# EAGLE schematic StepperBoard (EAGLE 9.6.2)
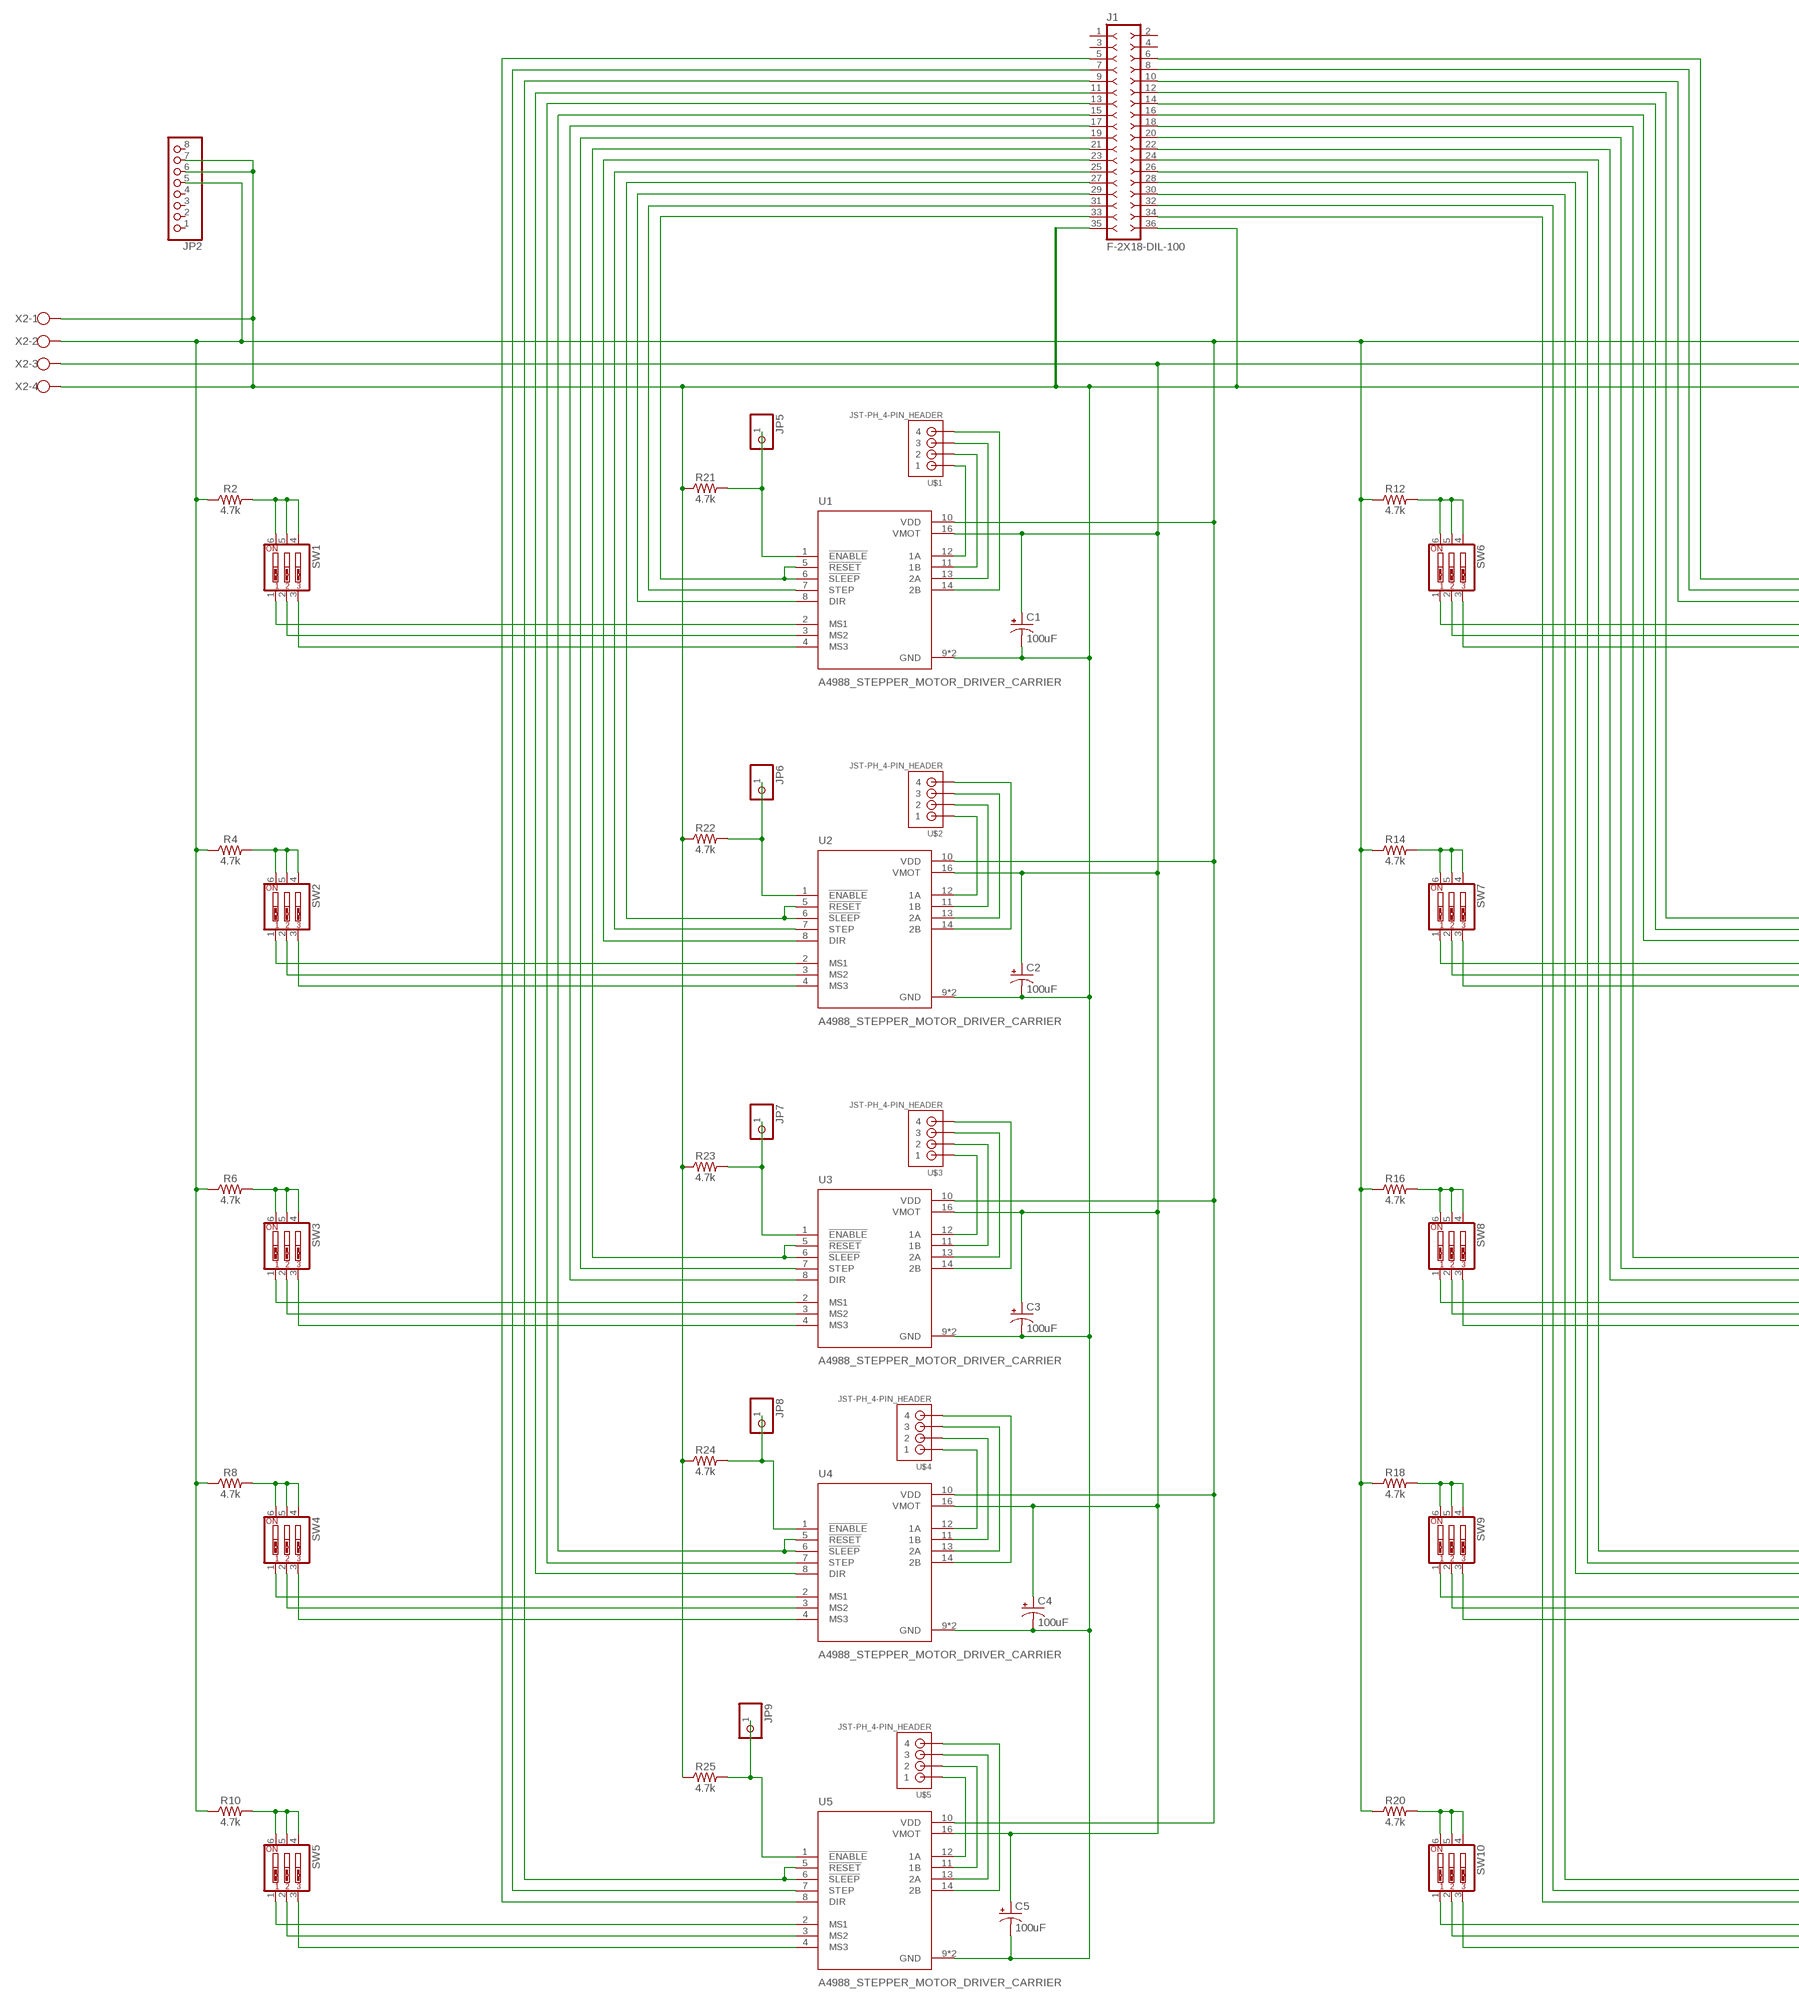
[diagram p0: schematic, sheet 1, part 1 of 2]
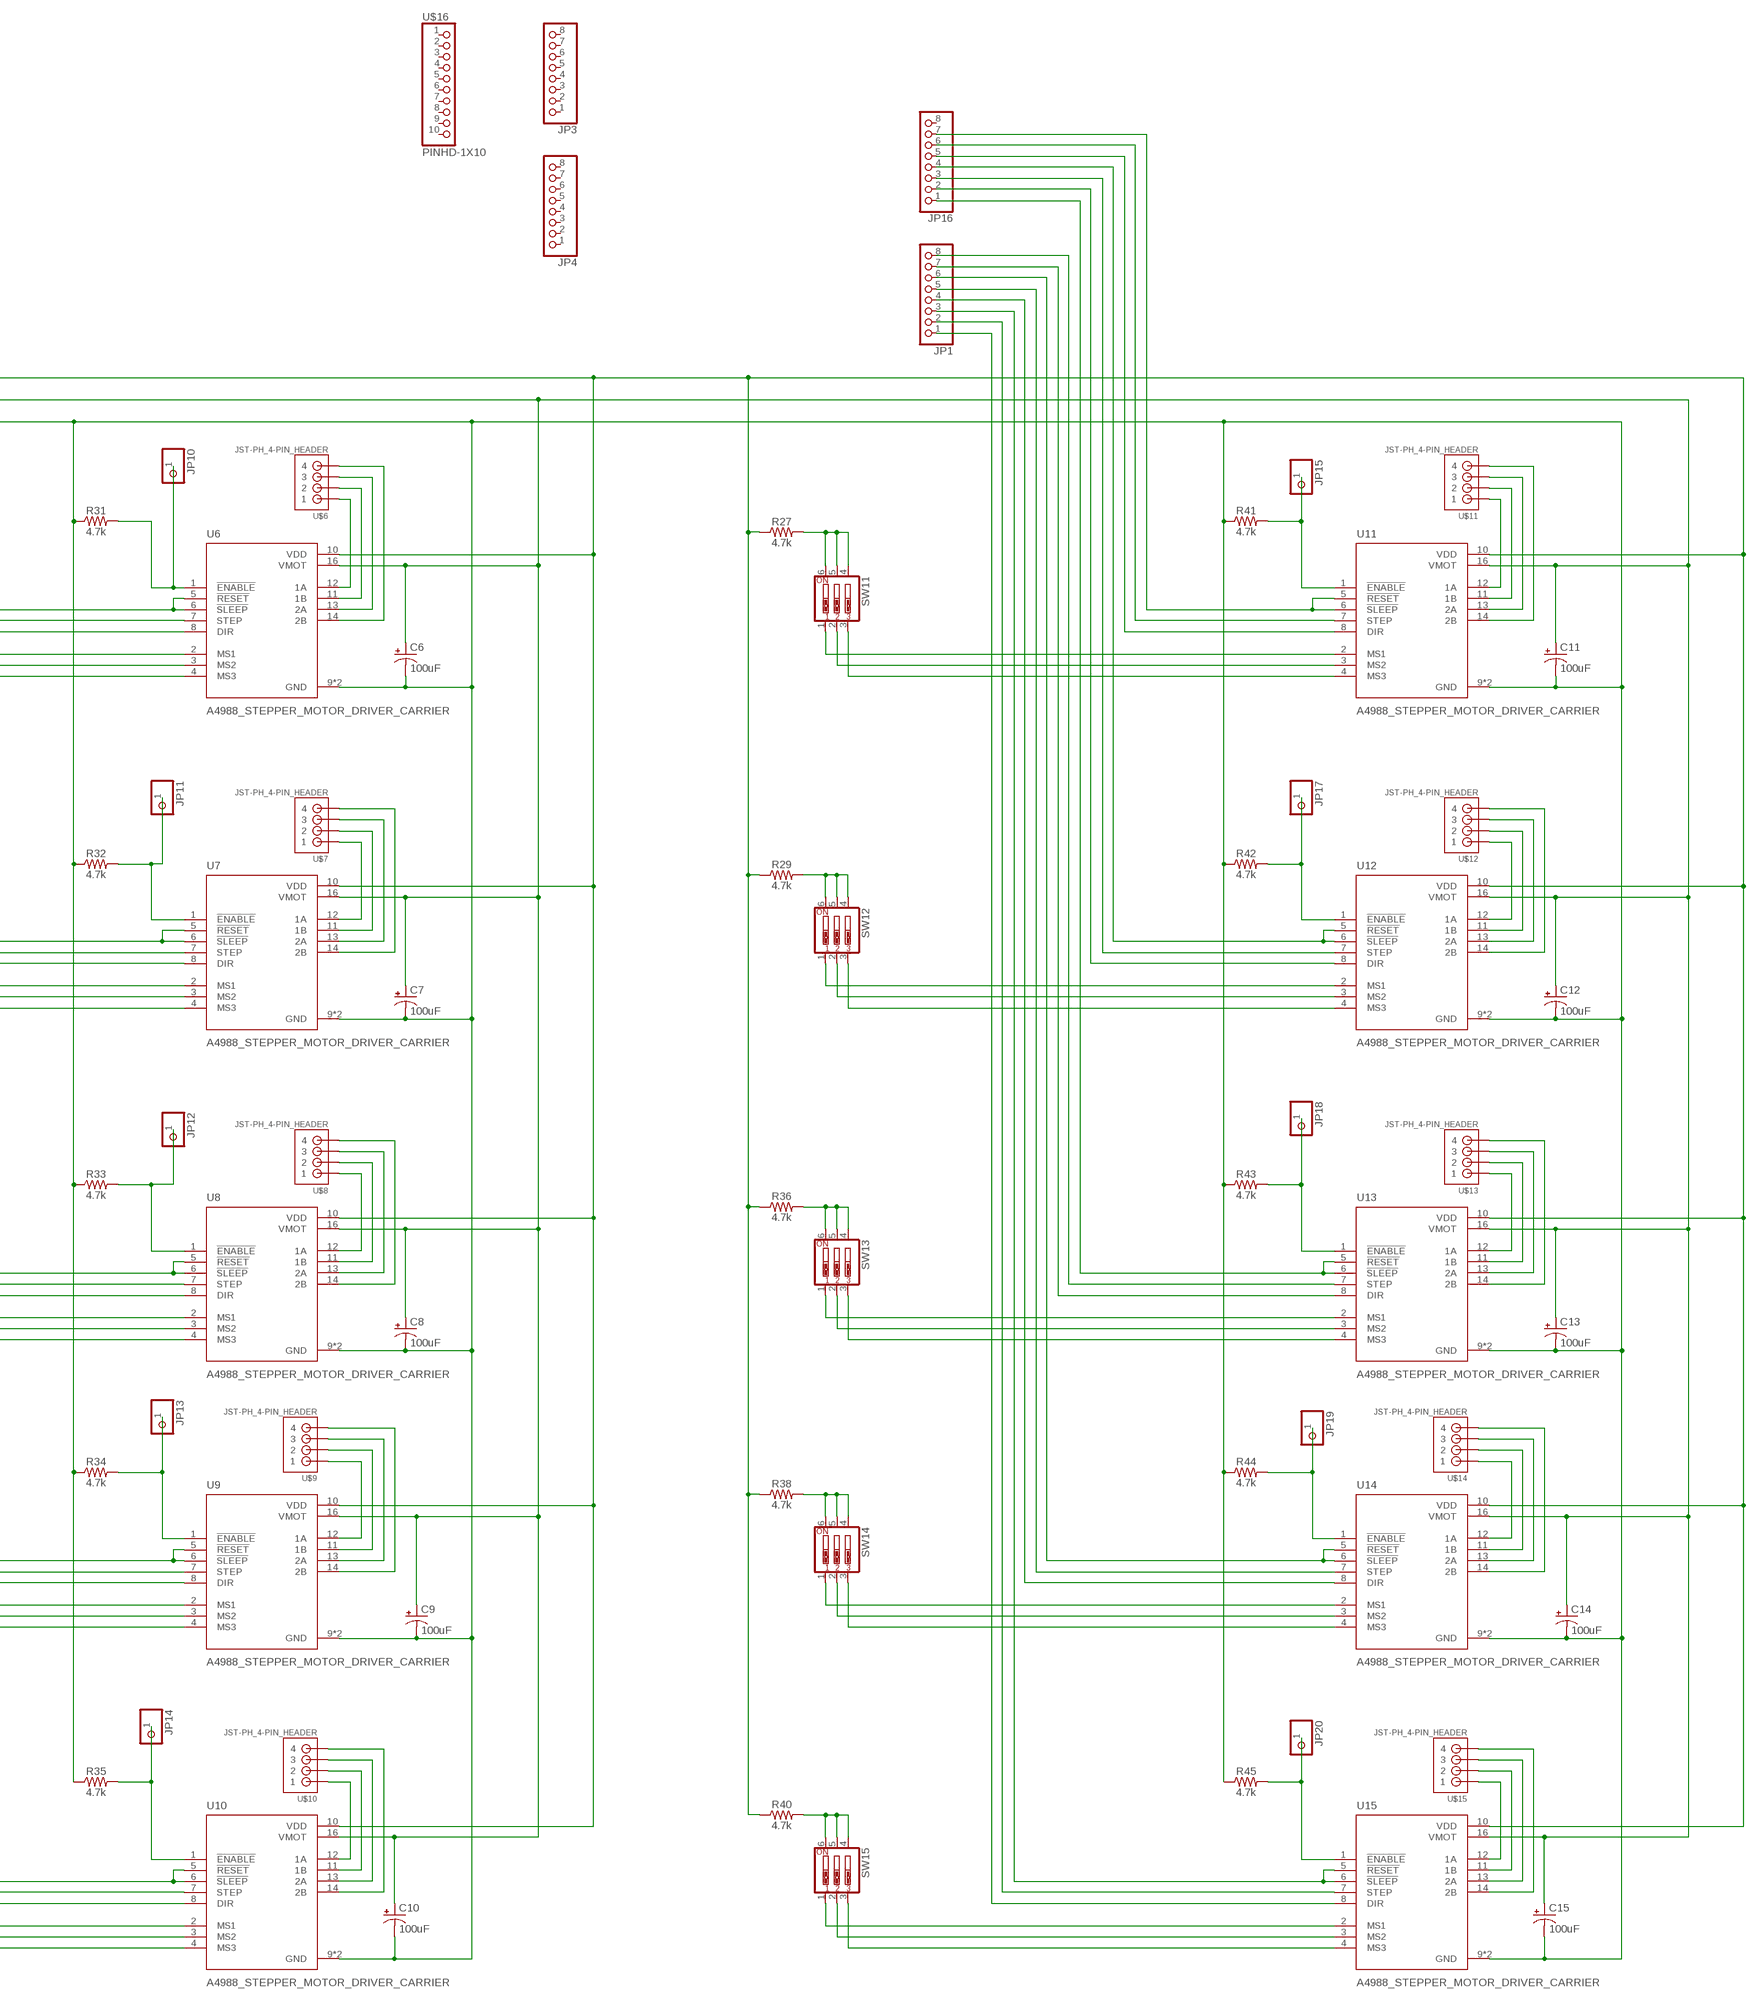
[diagram p1: schematic, sheet 1, part 2 of 2]

## Parts
C1  100uF  100UF-POLAR-RADIAL-2.5MM-25V-20%  [CPOL-RADIAL-2.5MM-6.5MM]
C2  100uF  100UF-POLAR-RADIAL-2.5MM-25V-20%  [CPOL-RADIAL-2.5MM-6.5MM]
C3  100uF  100UF-POLAR-RADIAL-2.5MM-25V-20%  [CPOL-RADIAL-2.5MM-6.5MM]
C4  100uF  100UF-POLAR-RADIAL-2.5MM-25V-20%  [CPOL-RADIAL-2.5MM-6.5MM]
C5  100uF  100UF-POLAR-RADIAL-2.5MM-25V-20%  [CPOL-RADIAL-2.5MM-6.5MM]
C6  100uF  100UF-POLAR-RADIAL-2.5MM-25V-20%  [CPOL-RADIAL-2.5MM-6.5MM]
C7  100uF  100UF-POLAR-RADIAL-2.5MM-25V-20%  [CPOL-RADIAL-2.5MM-6.5MM]
C8  100uF  100UF-POLAR-RADIAL-2.5MM-25V-20%  [CPOL-RADIAL-2.5MM-6.5MM]
C9  100uF  100UF-POLAR-RADIAL-2.5MM-25V-20%  [CPOL-RADIAL-2.5MM-6.5MM]
C10  100uF  100UF-POLAR-RADIAL-2.5MM-25V-20%  [CPOL-RADIAL-2.5MM-6.5MM]
C11  100uF  100UF-POLAR-RADIAL-2.5MM-25V-20%  [CPOL-RADIAL-2.5MM-6.5MM]
C12  100uF  100UF-POLAR-RADIAL-2.5MM-25V-20%  [CPOL-RADIAL-2.5MM-6.5MM]
C13  100uF  100UF-POLAR-RADIAL-2.5MM-25V-20%  [CPOL-RADIAL-2.5MM-6.5MM]
C14  100uF  100UF-POLAR-RADIAL-2.5MM-25V-20%  [CPOL-RADIAL-2.5MM-6.5MM]
C15  100uF  100UF-POLAR-RADIAL-2.5MM-25V-20%  [CPOL-RADIAL-2.5MM-6.5MM]
J1  F-2X18-DIL-100  [DIL-100-2X18]
JP1  PINHD-1X8  [1X08]
JP2  PINHD-1X8  [1X08]
JP3  PINHD-1X8  [1X08]
JP4  PINHD-1X8  [1X08]
JP5  PINHD-1X1  [1X01]
JP6  PINHD-1X1  [1X01]
JP7  PINHD-1X1  [1X01]
JP8  PINHD-1X1  [1X01]
JP9  PINHD-1X1  [1X01]
JP10  PINHD-1X1  [1X01]
JP11  PINHD-1X1  [1X01]
JP12  PINHD-1X1  [1X01]
JP13  PINHD-1X1  [1X01]
JP14  PINHD-1X1  [1X01]
JP15  PINHD-1X1  [1X01]
JP16  PINHD-1X8  [1X08]
JP17  PINHD-1X1  [1X01]
JP18  PINHD-1X1  [1X01]
JP19  PINHD-1X1  [1X01]
JP20  PINHD-1X1  [1X01]
R2  4.7k  4.7KOHM-0603-1/10W-1%  [0603]
R4  4.7k  4.7KOHM-0603-1/10W-1%  [0603]
R6  4.7k  4.7KOHM-0603-1/10W-1%  [0603]
R8  4.7k  4.7KOHM-0603-1/10W-1%  [0603]
R10  4.7k  4.7KOHM-0603-1/10W-1%  [0603]
R12  4.7k  4.7KOHM-0603-1/10W-1%  [0603]
R14  4.7k  4.7KOHM-0603-1/10W-1%  [0603]
R16  4.7k  4.7KOHM-0603-1/10W-1%  [0603]
R18  4.7k  4.7KOHM-0603-1/10W-1%  [0603]
R20  4.7k  4.7KOHM-0603-1/10W-1%  [0603]
R21  4.7k  4.7KOHM-0603-1/10W-1%  [0603]
R22  4.7k  4.7KOHM-0603-1/10W-1%  [0603]
R23  4.7k  4.7KOHM-0603-1/10W-1%  [0603]
R24  4.7k  4.7KOHM-0603-1/10W-1%  [0603]
R25  4.7k  4.7KOHM-0603-1/10W-1%  [0603]
R27  4.7k  4.7KOHM-0603-1/10W-1%  [0603]
R29  4.7k  4.7KOHM-0603-1/10W-1%  [0603]
R31  4.7k  4.7KOHM-0603-1/10W-1%  [0603]
R32  4.7k  4.7KOHM-0603-1/10W-1%  [0603]
R33  4.7k  4.7KOHM-0603-1/10W-1%  [0603]
R34  4.7k  4.7KOHM-0603-1/10W-1%  [0603]
R35  4.7k  4.7KOHM-0603-1/10W-1%  [0603]
R36  4.7k  4.7KOHM-0603-1/10W-1%  [0603]
R38  4.7k  4.7KOHM-0603-1/10W-1%  [0603]
R40  4.7k  4.7KOHM-0603-1/10W-1%  [0603]
R41  4.7k  4.7KOHM-0603-1/10W-1%  [0603]
R42  4.7k  4.7KOHM-0603-1/10W-1%  [0603]
R43  4.7k  4.7KOHM-0603-1/10W-1%  [0603]
R44  4.7k  4.7KOHM-0603-1/10W-1%  [0603]
R45  4.7k  4.7KOHM-0603-1/10W-1%  [0603]
SW1  SW_DIP-3  [EDG-03]
SW2  SW_DIP-3  [EDG-03]
SW3  SW_DIP-3  [EDG-03]
SW4  SW_DIP-3  [EDG-03]
SW5  SW_DIP-3  [EDG-03]
SW6  SW_DIP-3  [EDG-03]
SW7  SW_DIP-3  [EDG-03]
SW8  SW_DIP-3  [EDG-03]
SW9  SW_DIP-3  [EDG-03]
SW10  SW_DIP-3  [EDG-03]
SW11  SW_DIP-3  [EDG-03]
SW12  SW_DIP-3  [EDG-03]
SW13  SW_DIP-3  [EDG-03]
SW14  SW_DIP-3  [EDG-03]
SW15  SW_DIP-3  [EDG-03]
U1  A4988_STEPPER_MOTOR_DRIVER_CARRIER  [MODULE_A4988_STEPPER_MOTOR_DRIVER_CARRIER]
U2  A4988_STEPPER_MOTOR_DRIVER_CARRIER  [MODULE_A4988_STEPPER_MOTOR_DRIVER_CARRIER]
U3  A4988_STEPPER_MOTOR_DRIVER_CARRIER  [MODULE_A4988_STEPPER_MOTOR_DRIVER_CARRIER]
U4  A4988_STEPPER_MOTOR_DRIVER_CARRIER  [MODULE_A4988_STEPPER_MOTOR_DRIVER_CARRIER]
U5  A4988_STEPPER_MOTOR_DRIVER_CARRIER  [MODULE_A4988_STEPPER_MOTOR_DRIVER_CARRIER]
U6  A4988_STEPPER_MOTOR_DRIVER_CARRIER  [MODULE_A4988_STEPPER_MOTOR_DRIVER_CARRIER]
U7  A4988_STEPPER_MOTOR_DRIVER_CARRIER  [MODULE_A4988_STEPPER_MOTOR_DRIVER_CARRIER]
U8  A4988_STEPPER_MOTOR_DRIVER_CARRIER  [MODULE_A4988_STEPPER_MOTOR_DRIVER_CARRIER]
U9  A4988_STEPPER_MOTOR_DRIVER_CARRIER  [MODULE_A4988_STEPPER_MOTOR_DRIVER_CARRIER]
U10  A4988_STEPPER_MOTOR_DRIVER_CARRIER  [MODULE_A4988_STEPPER_MOTOR_DRIVER_CARRIER]
U11  A4988_STEPPER_MOTOR_DRIVER_CARRIER  [MODULE_A4988_STEPPER_MOTOR_DRIVER_CARRIER]
U12  A4988_STEPPER_MOTOR_DRIVER_CARRIER  [MODULE_A4988_STEPPER_MOTOR_DRIVER_CARRIER]
U13  A4988_STEPPER_MOTOR_DRIVER_CARRIER  [MODULE_A4988_STEPPER_MOTOR_DRIVER_CARRIER]
U14  A4988_STEPPER_MOTOR_DRIVER_CARRIER  [MODULE_A4988_STEPPER_MOTOR_DRIVER_CARRIER]
U15  A4988_STEPPER_MOTOR_DRIVER_CARRIER  [MODULE_A4988_STEPPER_MOTOR_DRIVER_CARRIER]
U$1  JST-PH_4-PIN_HEADER  [JST_B4B-PH_HEADER]
U$2  JST-PH_4-PIN_HEADER  [JST_B4B-PH_HEADER]
U$3  JST-PH_4-PIN_HEADER  [JST_B4B-PH_HEADER]
U$4  JST-PH_4-PIN_HEADER  [JST_B4B-PH_HEADER]
U$5  JST-PH_4-PIN_HEADER  [JST_B4B-PH_HEADER]
U$6  JST-PH_4-PIN_HEADER  [JST_B4B-PH_HEADER]
U$7  JST-PH_4-PIN_HEADER  [JST_B4B-PH_HEADER]
U$8  JST-PH_4-PIN_HEADER  [JST_B4B-PH_HEADER]
U$9  JST-PH_4-PIN_HEADER  [JST_B4B-PH_HEADER]
U$10  JST-PH_4-PIN_HEADER  [JST_B4B-PH_HEADER]
U$11  JST-PH_4-PIN_HEADER  [JST_B4B-PH_HEADER]
U$12  JST-PH_4-PIN_HEADER  [JST_B4B-PH_HEADER]
U$13  JST-PH_4-PIN_HEADER  [JST_B4B-PH_HEADER]
U$14  JST-PH_4-PIN_HEADER  [JST_B4B-PH_HEADER]
U$15  JST-PH_4-PIN_HEADER  [JST_B4B-PH_HEADER]
U$16  PINHD-1X10  [1X10-BIG]
X2  W237-4  [W237-4]

## Nets
N$1 [GND]: C1.2(-) C2.2(-) C3.2(-) C4.2(-) C5.2(-) C6.2(-) C7.2(-) C8.2(-) C9.2(-) C10.2(-) C11.2(-) C12.2(-) C13.2(-) C14.2(-) C15.2(-) J1.35 J1.36 JP2.6 JP2.7 R21.1 R22.1 R23.1 R24.1 R25.1 R31.1 R32.1 R33.1 R34.1 R35.1 R41.1 R42.1 R43.1 R44.1 R45.1 U1.9(GND) U1.15(GND) U2.9(GND) U2.15(GND) U3.9(GND) U3.15(GND) U4.9(GND) U4.15(GND) U5.9(GND) U5.15(GND) U6.9(GND) U6.15(GND) U7.9(GND) U7.15(GND) U8.9(GND) U8.15(GND) U9.9(GND) U9.15(GND) U10.9(GND) U10.15(GND) U11.9(GND) U11.15(GND) U12.9(GND) U12.15(GND) U13.9(GND) U13.15(GND) U14.9(GND) U14.15(GND) U15.9(GND) U15.15(GND) X2.1 X2.4
N$2 [VMOT]: C1.1(+) C2.1(+) C3.1(+) C4.1(+) C5.1(+) C6.1(+) C7.1(+) C8.1(+) C9.1(+) C10.1(+) C11.1(+) C12.1(+) C13.1(+) C14.1(+) C15.1(+) U1.16(VMOT) U2.16(VMOT) U3.16(VMOT) U4.16(VMOT) U5.16(VMOT) U6.16(VMOT) U7.16(VMOT) U8.16(VMOT) U9.16(VMOT) U10.16(VMOT) U11.16(VMOT) U12.16(VMOT) U13.16(VMOT) U14.16(VMOT) U15.16(VMOT) X2.3
N$3: JP5.1 R21.2 U1.1(!ENABLE)
N$4: J1.33 U1.5(!RESET) U1.6(!SLEEP)
N$5: R14.2 SW7.4 SW7.5 SW7.6
N$6: SW7.3 U7.4(MS3)
N$7: SW7.2 U7.3(MS2)
N$9: R4.2 SW2.4 SW2.5 SW2.6
N$10: SW2.3 U2.4(MS3)
N$11: SW2.2 U2.3(MS2)
N$12: SW2.1 U2.2(MS1)
N$13 [Motor]: U1.14(2B) U$1.P4
N$14 [Motor]: U1.13(2A) U$1.P3
N$15 [Motor]: U1.11(1B) U$1.P2
N$16 [Motor]: U1.12(1A) U$1.P1
N$17 [Motor]: U2.12(1A) U$2.P1
N$18: SW1.3 U1.4(MS3)
N$19: SW1.2 U1.3(MS2)
N$20: SW1.1 U1.2(MS1)
N$21: R2.2 SW1.4 SW1.5 SW1.6
N$22: R6.2 SW3.4 SW3.5 SW3.6
N$23: SW3.3 U3.4(MS3)
N$24: SW3.2 U3.3(MS2)
N$25: SW3.1 U3.2(MS1)
N$26: R8.2 SW4.4 SW4.5 SW4.6
N$27: SW4.3 U4.4(MS3)
N$28: SW4.2 U4.3(MS2)
N$29: SW4.1 U4.2(MS1)
N$30: R10.2 SW5.4 SW5.5 SW5.6
N$31: SW5.3 U5.4(MS3)
N$32: SW5.2 U5.3(MS2)
N$33: SW5.1 U5.2(MS1)
N$34: JP6.1 R22.2 U2.1(!ENABLE)
N$36: JP7.1 R23.2 U3.1(!ENABLE)
N$38: J1.31 U1.7(STEP)
N$39 [Motor]: U2.14(2B) U$2.P4
N$40 [Motor]: U2.13(2A) U$2.P3
N$41 [Motor]: U2.11(1B) U$2.P2
N$42 [Motor]: U3.14(2B) U$3.P4
N$43 [Motor]: U3.13(2A) U$3.P3
N$44 [Motor]: U3.11(1B) U$3.P2
N$45 [Motor]: U3.12(1A) U$3.P1
N$46 [Motor]: U4.14(2B) U$4.P4
N$47 [Motor]: U4.13(2A) U$4.P3
N$48 [Motor]: U4.11(1B) U$4.P2
N$49 [Motor]: U4.12(1A) U$4.P1
N$50 [Motor]: U5.12(1A) U$5.P1
N$51 [Motor]: U5.11(1B) U$5.P2
N$52 [Motor]: U5.13(2A) U$5.P3
N$53 [Motor]: U5.14(2B) U$5.P4
N$54: JP8.1 R24.2 U4.1(!ENABLE)
N$55: SW7.1 U7.2(MS1)
N$56: R16.2 SW8.4 SW8.5 SW8.6
N$57: SW8.3 U8.4(MS3)
N$58: SW8.2 U8.3(MS2)
N$59: SW8.1 U8.2(MS1)
N$60: R18.2 SW9.4 SW9.5 SW9.6
N$61: SW9.3 U9.4(MS3)
N$62: SW9.2 U9.3(MS2)
N$63: SW9.1 U9.2(MS1)
N$64: R20.2 SW10.4 SW10.5 SW10.6
N$65: SW10.3 U10.4(MS3)
N$66: SW10.2 U10.3(MS2)
N$67: SW10.1 U10.2(MS1)
N$68: R12.2 SW6.4 SW6.5 SW6.6
N$69: SW6.3 U6.4(MS3)
N$70: SW6.2 U6.3(MS2)
N$71: SW6.1 U6.2(MS1)
N$72: J1.29 U1.8(DIR)
N$73 [Motor]: U6.14(2B) U$6.P4
N$74 [Motor]: U6.13(2A) U$6.P3
N$75 [Motor]: U6.11(1B) U$6.P2
N$76 [Motor]: U6.12(1A) U$6.P1
N$77 [Motor]: U7.12(1A) U$7.P1
N$78 [Motor]: U7.14(2B) U$7.P4
N$79 [Motor]: U7.13(2A) U$7.P3
N$80: JP2.5 R2.1 R4.1 R6.1 R8.1 R10.1 R12.1 R14.1 R16.1 R18.1 R20.1 R27.1 R29.1 R36.1 R38.1 R40.1 U1.10(VDD) U2.10(VDD) U3.10(VDD) U4.10(VDD) U5.10(VDD) U6.10(VDD) U7.10(VDD) U8.10(VDD) U9.10(VDD) U10.10(VDD) U11.10(VDD) U12.10(VDD) U13.10(VDD) U14.10(VDD) U15.10(VDD) X2.2
N$82 [Motor]: U7.11(1B) U$7.P2
N$83 [Motor]: U8.14(2B) U$8.P4
N$84 [Motor]: U8.13(2A) U$8.P3
N$85 [Motor]: U8.11(1B) U$8.P2
N$86 [Motor]: U8.12(1A) U$8.P1
N$87 [Motor]: U9.14(2B) U$9.P4
N$88 [Motor]: U9.13(2A) U$9.P3
N$89 [Motor]: U9.11(1B) U$9.P2
N$90 [Motor]: U9.12(1A) U$9.P1
N$91 [Motor]: U10.12(1A) U$10.P1
N$92 [Motor]: U10.11(1B) U$10.P2
N$93 [Motor]: U10.13(2A) U$10.P3
N$94 [Motor]: U10.14(2B) U$10.P4
N$95: J1.27 U2.5(!RESET) U2.6(!SLEEP)
N$96: JP10.1 R31.2 U6.1(!ENABLE)
N$98: JP11.1 R32.2 U7.1(!ENABLE)
N$100: JP12.1 R33.2 U8.1(!ENABLE)
N$102: JP13.1 R34.2 U9.1(!ENABLE)
N$104: JP14.1 R35.2 U10.1(!ENABLE)
N$106: R29.2 SW12.4 SW12.5 SW12.6
N$107: SW12.3 U12.4(MS3)
N$108: SW12.2 U12.3(MS2)
N$109: SW12.1 U12.2(MS1)
N$110: R36.2 SW13.4 SW13.5 SW13.6
N$111: SW13.3 U13.4(MS3)
N$112: SW13.2 U13.3(MS2)
N$113: SW13.1 U13.2(MS1)
N$114: R38.2 SW14.4 SW14.5 SW14.6
N$115: SW14.3 U14.4(MS3)
N$116: SW14.2 U14.3(MS2)
N$117: SW14.1 U14.2(MS1)
N$118: R40.2 SW15.4 SW15.5 SW15.6
N$119: SW15.3 U15.4(MS3)
N$120: SW15.2 U15.3(MS2)
N$121: SW15.1 U15.2(MS1)
N$122: R27.2 SW11.4 SW11.5 SW11.6
N$123: JP9.1 R25.2 U5.1(!ENABLE)
N$125: SW11.3 U11.4(MS3)
N$126: SW11.2 U11.3(MS2)
N$127: SW11.1 U11.2(MS1)
N$128: J1.25 U2.7(STEP)
N$129 [Motor]: U11.14(2B) U$11.P4
N$130 [Motor]: U11.13(2A) U$11.P3
N$131 [Motor]: U11.11(1B) U$11.P2
N$132 [Motor]: U11.12(1A) U$11.P1
N$133 [Motor]: U12.12(1A) U$12.P1
N$134 [Motor]: U12.14(2B) U$12.P4
N$135 [Motor]: U12.13(2A) U$12.P3
N$136 [Motor]: U12.11(1B) U$12.P2
N$137 [Motor]: U13.14(2B) U$13.P4
N$138 [Motor]: U13.13(2A) U$13.P3
N$139 [Motor]: U13.11(1B) U$13.P2
N$140 [Motor]: U13.12(1A) U$13.P1
N$141 [Motor]: U14.14(2B) U$14.P4
N$142 [Motor]: U14.13(2A) U$14.P3
N$143 [Motor]: U14.11(1B) U$14.P2
N$144 [Motor]: U14.12(1A) U$14.P1
N$145 [Motor]: U15.12(1A) U$15.P1
N$146 [Motor]: U15.11(1B) U$15.P2
N$147 [Motor]: U15.13(2A) U$15.P3
N$148 [Motor]: U15.14(2B) U$15.P4
N$149: J1.23 U2.8(DIR)
N$150: JP15.1 R41.2 U11.1(!ENABLE)
N$152: JP17.1 R42.2 U12.1(!ENABLE)
N$154: JP18.1 R43.2 U13.1(!ENABLE)
N$156: JP19.1 R44.2 U14.1(!ENABLE)
N$158: JP20.1 R45.2 U15.1(!ENABLE)
N$160: J1.21 U3.5(!RESET) U3.6(!SLEEP)
N$161: J1.19 U3.7(STEP)
N$162: J1.17 U3.8(DIR)
N$163: J1.15 U4.5(!RESET) U4.6(!SLEEP)
N$164: J1.13 U4.7(STEP)
N$165: J1.11 U4.8(DIR)
N$166: J1.9 U5.5(!RESET) U5.6(!SLEEP)
N$167: J1.7 U5.7(STEP)
N$168: J1.5 U5.8(DIR)
N$169: J1.34 U10.8(DIR)
N$170: J1.32 U10.7(STEP)
N$171: J1.30 U10.5(!RESET) U10.6(!SLEEP)
N$172: J1.28 U9.8(DIR)
N$173: J1.26 U9.7(STEP)
N$174: J1.24 U9.5(!RESET) U9.6(!SLEEP)
N$175: J1.22 U8.8(DIR)
N$176: J1.20 U8.7(STEP)
N$177: J1.18 U8.5(!RESET) U8.6(!SLEEP)
N$178: J1.16 U7.8(DIR)
N$179: J1.14 U7.7(STEP)
N$180: J1.12 U7.5(!RESET) U7.6(!SLEEP)
N$181: J1.10 U6.8(DIR)
N$182: J1.8 U6.7(STEP)
N$183: J1.6 U6.5(!RESET) U6.6(!SLEEP)
N$184: JP1.1 U15.8(DIR)
N$186: JP1.2 U15.7(STEP)
N$187: JP1.3 U15.5(!RESET) U15.6(!SLEEP)
N$188: JP1.4 U14.8(DIR)
N$189: JP1.5 U14.7(STEP)
N$190: JP1.6 U14.5(!RESET) U14.6(!SLEEP)
N$191: JP1.7 U13.8(DIR)
N$192: JP1.8 U13.7(STEP)
N$193: JP16.1 U13.5(!RESET) U13.6(!SLEEP)
N$194: JP16.2 U12.8(DIR)
N$195: JP16.3 U12.7(STEP)
N$196: JP16.4 U12.5(!RESET) U12.6(!SLEEP)
N$197: JP16.5 U11.8(DIR)
N$198: JP16.6 U11.7(STEP)
N$199: JP16.7 U11.5(!RESET) U11.6(!SLEEP)
Unconnected: J1.1 J1.2 J1.3 J1.4 JP2.1 JP2.2 JP2.3 JP2.4 JP2.8 JP3.1 JP3.2 JP3.3 JP3.4 JP3.5 JP3.6 JP3.7 JP3.8 JP4.1 JP4.2 JP4.3 JP4.4 JP4.5 JP4.6 JP4.7 JP4.8 JP16.8 U$16.1 U$16.2 U$16.3 U$16.4 U$16.5 U$16.6 U$16.7 U$16.8 U$16.9 U$16.10

## Library data of the parts
C1-C15 = SparkFun-Capacitors:100UF-POLAR: 100µF polarized capacitors A capacitor is a passive two-terminal electrical component used to store electrical energy temporarily in an electric field.; PROD_ID: CAP-08439
J1 = con-headers-jp:F-2X18-: FEMALE HEADER
JP1-JP4 JP16 = pinhead:PINHD-1X8: PIN HEADER
JP5-JP15 JP17-JP20 = pinhead:PINHD-1X1: PIN HEADER
R2 R4 R6 R8 R10 R12 R14 R16 R18 R20-R25 R27 R29 R31-R36 R38 R40-R45 = SparkFun-Resistors:4.7KOHM: 4.7kΩ resistor A resistor is a passive two-terminal electrical component that implements electrical resistance as a circuit element. Resistors act to reduce current flow, and, at the same time, act to lower voltage levels within circuits. - Wikipedia; PROD_ID: RES-07857
SW1-SW15 = special:SW_DIP-3: DIP SWITCH
U1-U15 = A4988_STEPPER_MOTOR_DRIVER_CARRIER:A4988_STEPPER_MOTOR_DRIVER_CARRIER: Stepper motor controler; IC: A4988; 1A; Uin mot: 8÷35V Check availability <https://pricing.snapeda.com/parts/A4988%20STEPPER%20MOTOR%20DRIVER%20CARRIER/Pololu/view-part?ref=eda>; AVAILABILITY: Not in stock; DESCRIPTION: Stepper Motor Driver; MF: Pololu; MP: A4988 STEPPER MOTOR DRIVER CARRIER; PACKAGE: None; PRICE: None
U$1-U$15 = SRG:JST-PH_4-PIN_HEADER: 4-pin JST PH Shrouded Header, top entry P/N B4B-PH-K-S Mating connector PHR-4 Mating cable assembly: Sparkfun PRT-09916 <http://www.sparkfun.com/products/9916>
U$16 = adafruit:PINHD-1X10: Pin header 1x10 0.1" spacing With round pins
X2 = con-wago-500:W237-4: WAGO SCREW CLAMP; OC_FARNELL: unknown; OC_NEWARK: unknown

## Net classes
1 Motor: width 0.508 mm
2 VMOT: width 0.508 mm
3 GND: width 0.508 mm